# EAGLE schematic oresat0-plusz-end-cap (EAGLE 9.6.2)
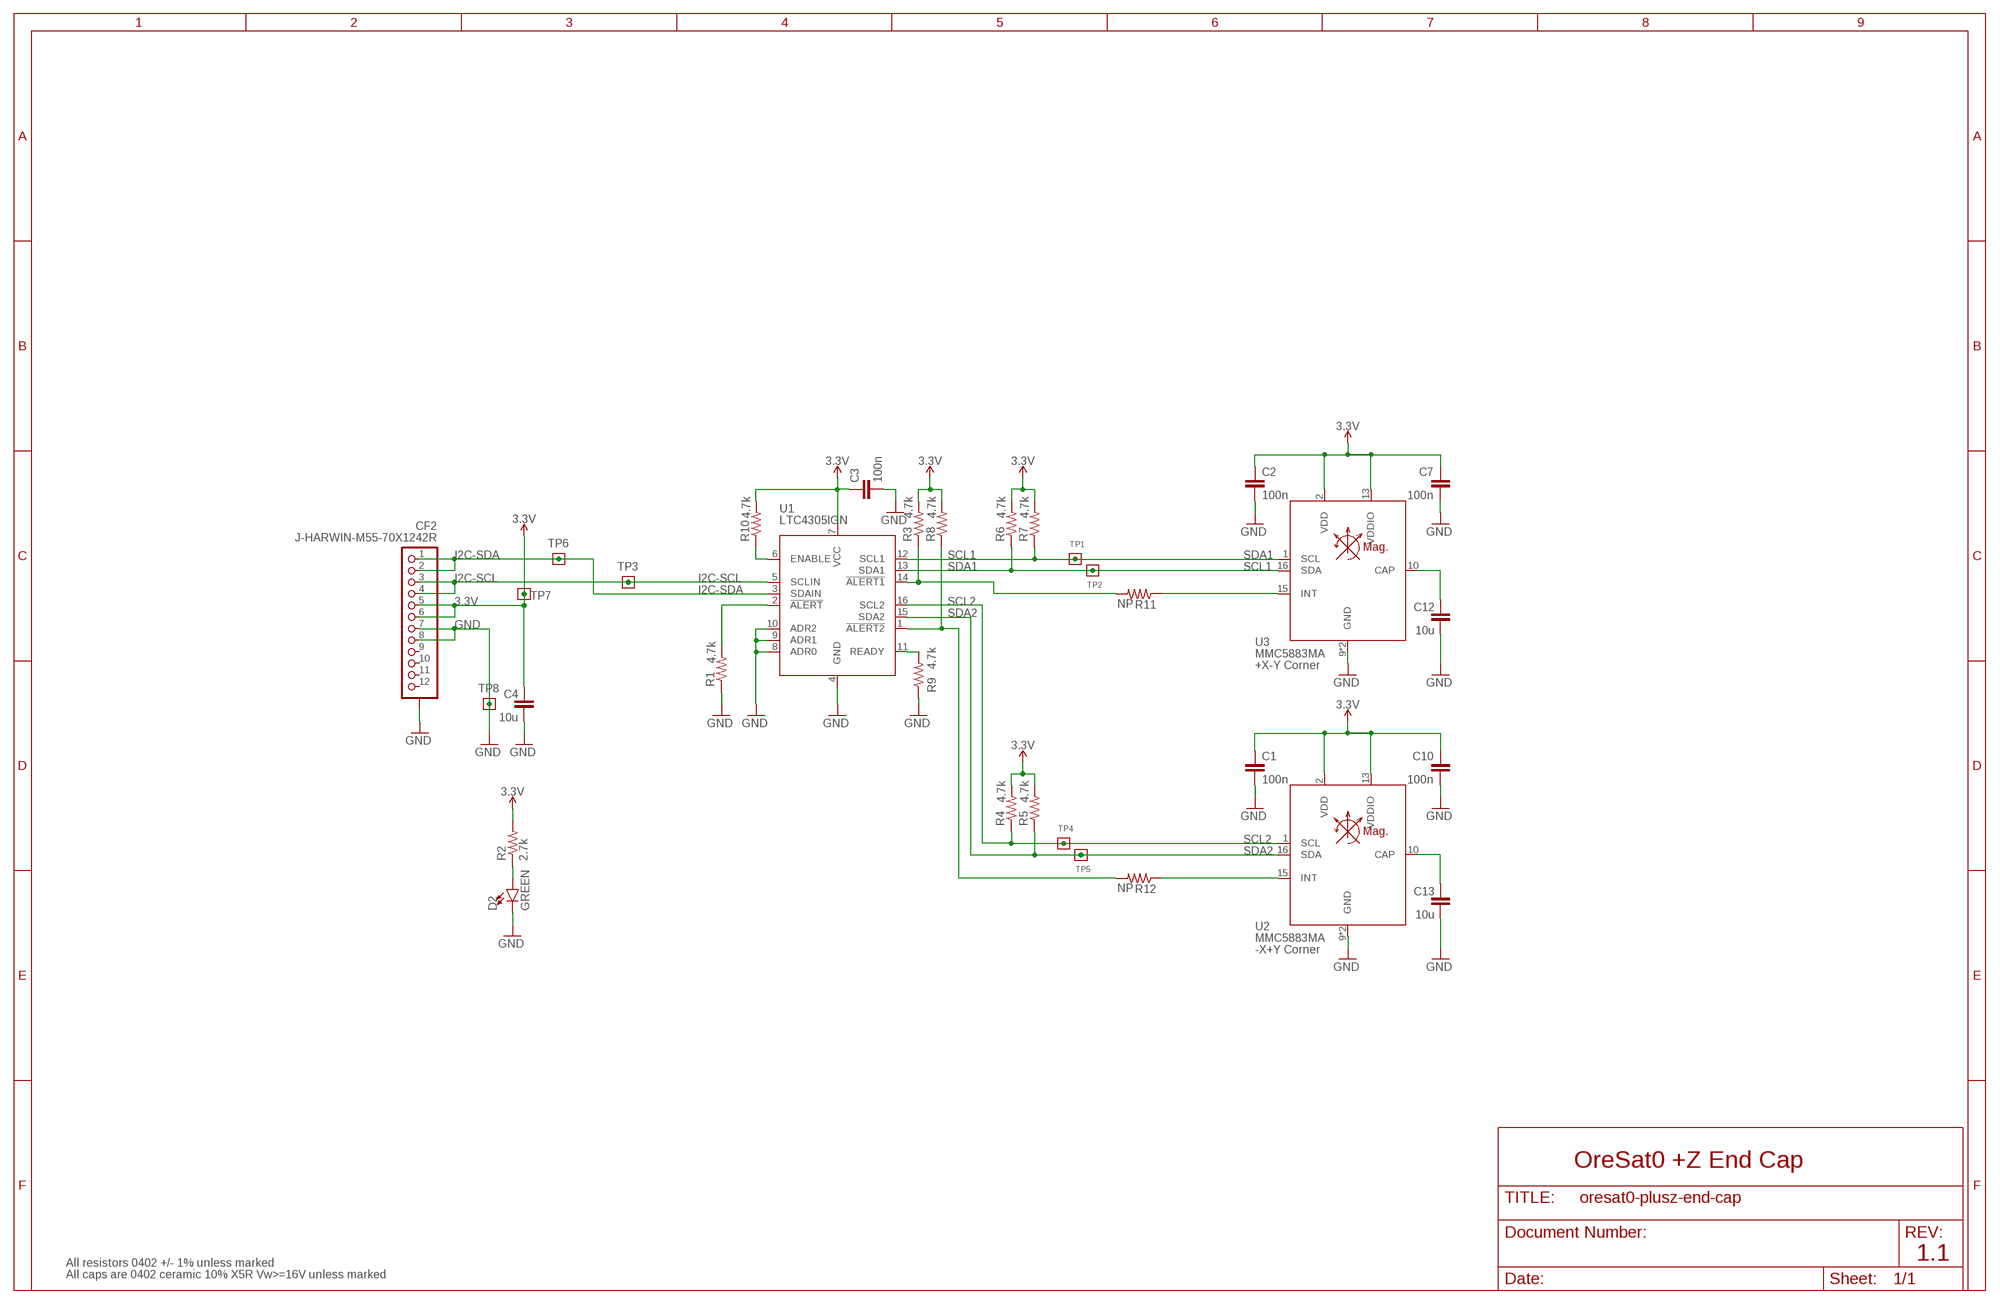
[diagram p0: schematic, sheet 1]

## Parts
C1  100n  C-EU0603-B-NOSILK  [.0603-B-NOSILK]
C2  100n  C-EU0603-B-NOSILK  [.0603-B-NOSILK]
C3  100n  C-EU0603-B-NOSILK  [.0603-B-NOSILK]
C4  10u  C-EU0603-B-NOSILK  [.0603-B-NOSILK]
C7  100n  C-EU0603-B-NOSILK  [.0603-B-NOSILK]
C10  100n  C-EU0603-B-NOSILK  [.0603-B-NOSILK]
C12  10u  C-EU0603-B-NOSILK  [.0603-B-NOSILK]
C13  10u  C-EU0603-B-NOSILK  [.0603-B-NOSILK]
CF2  J-HARWIN-M55-70X1242R  [HARWIN-M55-70X1242R]
D2  GREEN  LED-GREEN0603  [LED-0603]
R1  4.7k  R-US_0603-B-NOSILK  [.0603-B-NOSILK]
R2  2.7k  R-US_0603-B-NOSILK  [.0603-B-NOSILK]
R3  4.7k  R-US_0603-B-NOSILK  [.0603-B-NOSILK]
R4  4.7k  R-US_0603-B-NOSILK  [.0603-B-NOSILK]
R5  4.7k  R-US_0603-B-NOSILK  [.0603-B-NOSILK]
R6  4.7k  R-US_0603-B-NOSILK  [.0603-B-NOSILK]
R7  4.7k  R-US_0603-B-NOSILK  [.0603-B-NOSILK]
R8  4.7k  R-US_0603-B-NOSILK  [.0603-B-NOSILK]
R9  4.7k  R-US_0603-B-NOSILK  [.0603-B-NOSILK]
R10  4.7k  R-US_0603-B-NOSILK  [.0603-B-NOSILK]
R11  NP  R-US_0603-B-NOSILK  [.0603-B-NOSILK]
R12  NP  R-US_0603-B-NOSILK  [.0603-B-NOSILK]
TP1  TEST-POINT-LARGE-SQUARE  [1X01]
TP2  TEST-POINT-LARGE-SQUARE  [1X01]
TP3  TEST-POINT-LARGE-SQUARE  [1X01]
TP4  TEST-POINT-LARGE-SQUARE  [1X01]
TP5  TEST-POINT-LARGE-SQUARE  [1X01]
TP6  TEST-POINT-LARGE-SQUARE  [1X01]
TP7  TEST-POINT-LARGE-SQUARE  [1X01]
TP8  TEST-POINT-LARGE-SQUARE  [1X01]
U1  LTC4305IGN  LTC4305  [16-SSOP]
U2  MMC5883MA  [LGA-16(3X3)]
U3  MMC5883MA  [LGA-16(3X3)]

## Nets
3.3V: C1.1 C2.1 C3.1 C4.1 C7.1 C10.1 CF2.5 CF2.6 R2.2 R3.2 R4.2 R5.2 R6.2 R7.2 R8.2 R10.2 TP7.1 U1.7(VCC) U2.2(VDD) U2.13(VDDIO) U3.2(VDD) U3.13(VDDIO)
GND: C1.2 C2.2 C3.2 C4.2 C7.2 C10.2 C12.2 C13.2 CF2.7 CF2.8 CF2.P$1(SHIELDS) CF2.P$2(SHIELDS) CF2.P$3(SHIELDS) CF2.P$4(SHIELDS) D2.C R1.1 R9.1 TP8.1 U1.4(GND) U1.8(ADR0) U1.9(ADR1) U1.10(ADR2) U2.9(GND) U2.11(GND) U3.9(GND) U3.11(GND)
I2C-SCL: CF2.3 CF2.4 TP3.1 U1.5(SCLIN)
I2C-SDA: CF2.1 CF2.2 TP6.1 U1.3(SDAIN)
N$1: R9.2 U1.11(READY)
N$2: C12.1 U3.10(CAP)
N$3: R1.2 U1.2(!ALERT)
N$4: R3.1 R11.2 U1.14(!ALERT1)
N$5: C13.1 U2.10(CAP)
N$6: R8.1 R12.2 U1.1(!ALERT2)
N$7: R11.1 U3.15(INT)
N$8: R10.1 U1.6(ENABLE)
N$10: R12.1 U2.15(INT)
N$271: D2.A R2.1
SCL1: R7.1 TP1.1 U1.12(SCL1) U3.1(SCL)
SCL2: R4.1 TP4.1 U1.16(SCL2) U2.1(SCL)
SDA1: R6.1 TP2.1 U1.13(SDA1) U3.16(SDA)
SDA2: R5.1 TP5.1 U1.15(SDA2) U2.16(SDA)
Unconnected: CF2.9 CF2.10 CF2.11 CF2.12

## Notes on the sheet
- +X-Y Corner
- -X+Y Corner
- OreSat0 +Z End Cap
- 1.1
- All resistors 0402 +/- 1% unless marked
- All caps are 0402 ceramic 10% X5R Vw>=16V unless marked

## Library data of the parts
C1-C3 C7 C10 = oresat-rcl:C-EU: CAPACITOR, European symbol; DIS: Digi-Key; DPN: 1276-CL10B104KB8NNNLCT-ND; MFR: Samsung; MPN: CL10B104KB8NNNL
C4 C12 C13 = oresat-rcl:C-EU: CAPACITOR, European symbol; DIS: Digi-Key; DPN: 490-14461-1-ND; MFR: Murata; MPN: GRM188D71A106KA73D
CF2 = J-Harwin-M55-70X1242R-12pin-1.27mm-M-vertical:J-HARWIN-M55-70X1242R; DIS: Digi-Key; DPN: A122888-ND; MFR: Harwin; MPN: M55-7011242R
D2 = SparkFun-LED:LED-GREEN: Green SMD LED Used in manufacturing of various products at SparkFun Packages: 0603 - SMD 0603 package [Product Link] <http://www.futureelectronics.com/en/technologies/semiconductors/optoelectronics/leds/Pages/9894312-LTST-C190GKT.aspx?CrossPart=HSMG-C190&IM=0> LilyPad 1206 - SMD1206 LilyPad package [Product Link] <http://www.futureelectronics.com/en/Technologies/Product.aspx?ProductID=IN150NGHARVATEKCORPORATION2049943&IM=0> 1206 - SMD1206 package [Product Link] <http://www.futureelectronics.com/en/technologies/semiconductors/optoelectronics/leds/Pages/8315665-LTST-C150KGKT.aspx?IM=0> 1206 Bottom Mount -SMD 1206 Bottom Mount [Product Link] <http://www.digikey.com/product-detail/en/lite-on-inc/LTST-C230KGKT/160-1456-1-ND/386854> SparkFun Products: Pro Mini 328 -5V <https://www.sparkfun.com/products/821> RedBoard <https://www.sparkfun.com/products/12757> MP3 Trigger <https://www.sparkfun.com/products/13720> Makey Makey <https://www.sparkfun.com/products/11076>; DIS: Digi-Key; DPN: 511-1584-1-ND; MFR: Rohn; MPN: SML-E12M8WT86; PROD_ID: DIO-00821
R1 R3-R10 = oresat-rcl:R-US_: RESISTOR, American symbol; DIS: Digi-Key; DPN: A129696CT-ND; MFR: TE Connectivity; MPN: CRGCQ0603F4K7
R2 = oresat-rcl:R-US_: RESISTOR, American symbol; DIS: Digi-Key; DPN: A129693CT-ND; MFR: TE Connectivity; MPN: CRGCQ0603F2K7
R11 R12 = oresat-rcl:R-US_: RESISTOR, American symbol
TP1-TP8 = oresat-misc:TEST-POINT-LARGE-SQUARE
U1 = U-Linear-LTC4305-2-Channel-Bus-Multiplexer:LTC4305; DIS: Digi-Key; DPN: LTC4305IGN#PBF-ND; MFR: Analog; MPN: LTC4305IGN#PBF
U2 U3 = U-Memsic-MMC5883-3-Axis-Magnetometer:MMC5883MA; DIS: Digi-Key; DPN: 1267-1072-1-ND; MFR: Memsic; MPN: MMC5883MA